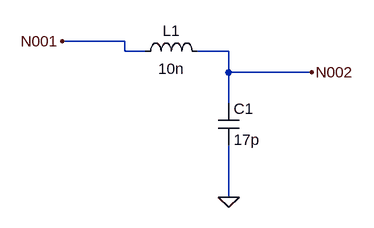
[diagram p0: schematic PasaBajasConcentrados.asc]
PasaBajasConcentrados.asc, the LTspice schematic file:
Version 4
SHEET 1 880 680
WIRE 80 96 -16 96
WIRE 80 112 80 96
WIRE 112 112 80 112
WIRE 240 112 192 112
WIRE 240 144 240 112
WIRE 368 144 240 144
WIRE 240 192 240 144
WIRE 240 336 240 256
FLAG -16 96 N001
FLAG 368 144 N002
FLAG 240 336 0
SYMBOL cap 224 192 R0
SYMATTR InstName C1
SYMATTR Value 17p
SYMBOL ind 96 128 R270
WINDOW 0 32 56 VTop 2
WINDOW 3 5 56 VBottom 2
SYMATTR InstName L1
SYMATTR Value 10n

The netlist it stands for:
* PasaBajasConcentrados.asc
C1 N002 0 17p
L1 N001 N002 10n
.backanno
.end